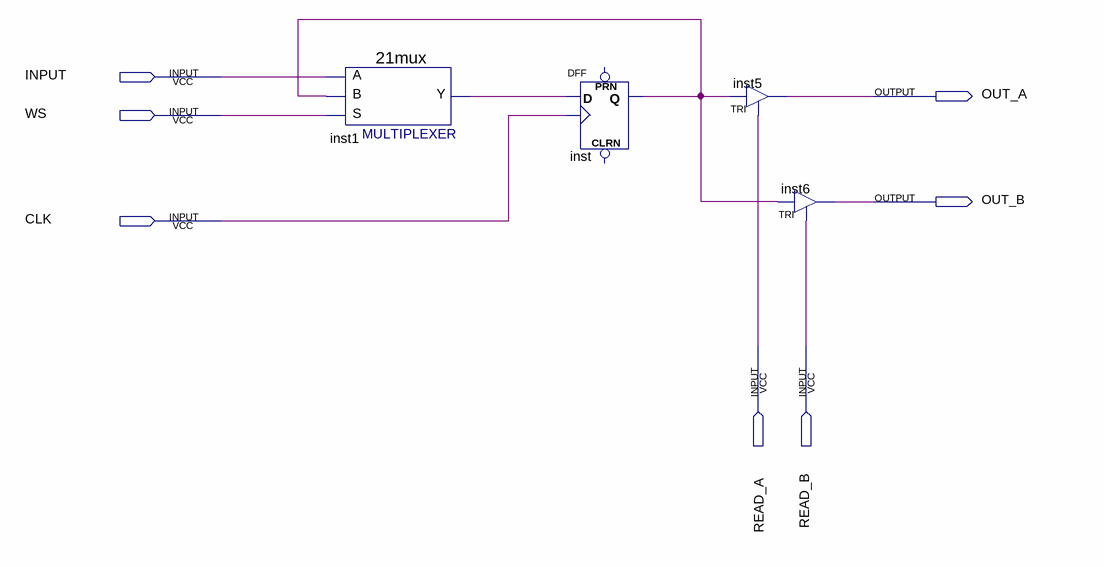
[diagram p0: schematic sheet]
// Quartus schematic RFC.bdf as structural Verilog: 4 symbols, 7 pins
module RFC (
  input  INPUT,
  input  WS,
  input  CLK,
  input  READ_A,
  input  READ_B,
  output OUT_A,
  output OUT_B
);

  wire inst1_y, inst_q;

  \21mux  inst1 (.S(WS), .B(inst_q), .A(INPUT), .Y(inst1_y));
  DFF inst (.CLK(CLK), .D(inst1_y), .Q(inst_q));  // open: CLRN, PRN
  TRI inst5 (.IN(inst_q), .OE(READ_A), .OUT(OUT_A));
  TRI inst6 (.IN(inst_q), .OE(READ_B), .OUT(OUT_B));
endmodule
